# EAGLE design SimpleSwitchPirLightCO2_RFM69W (EAGLE 6.6.0)
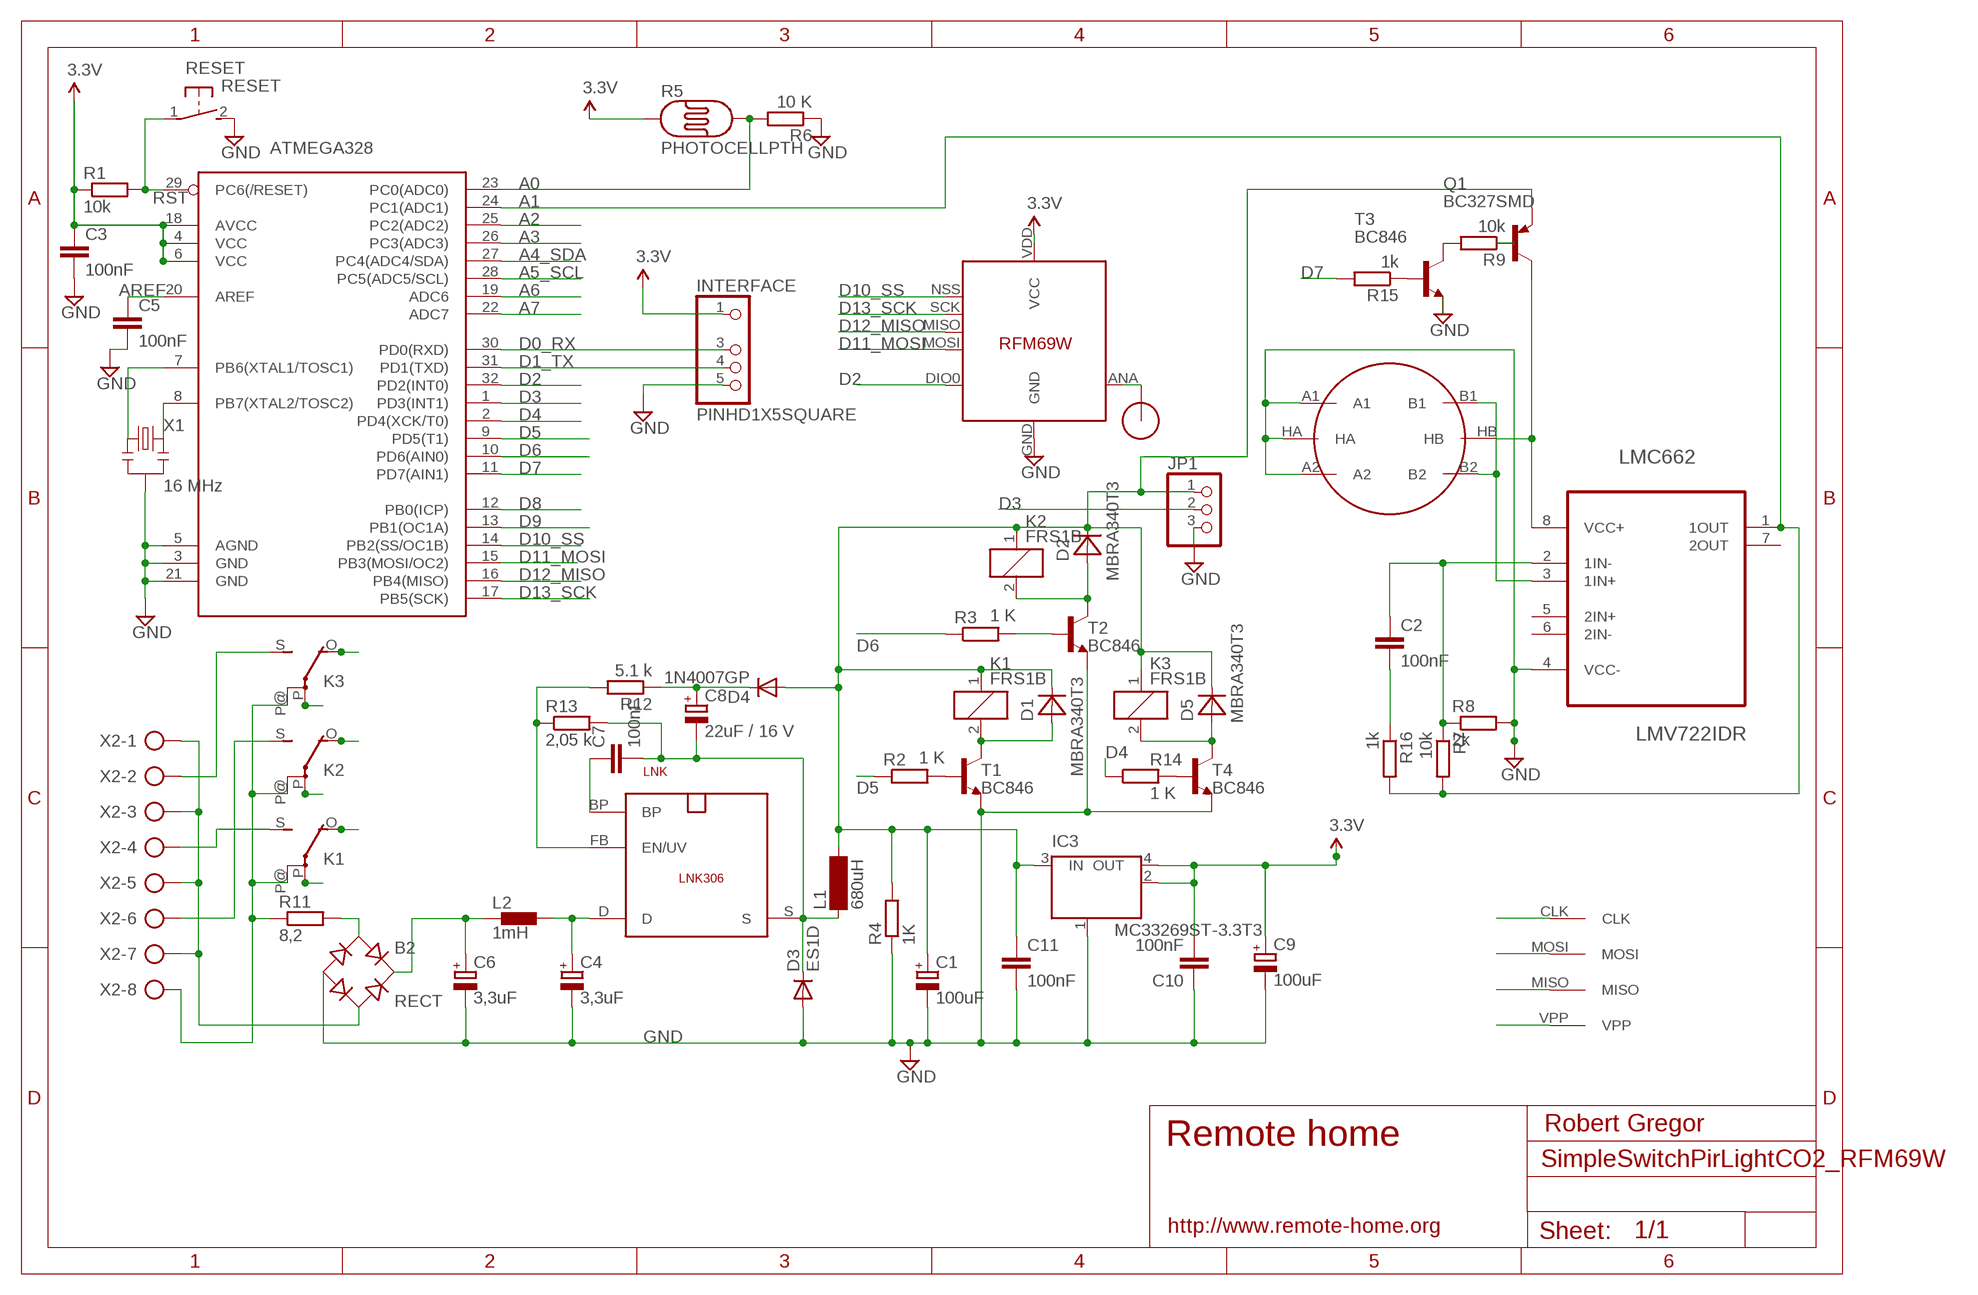
[diagram p0: schematic, sheet 1]

## Parts
ATMEGA328  ATMega-328  ATMEGA168/328TQFP32  [TQFP32-08]
B2  RECT  RECTIFIER-S40  [TO-269AA]
C1  100uF  CPOL-EUSMCB  [SMC_B]
C2  100nF  C-EUC2012  [C2012]
C3  100nF  C-EUC2012  [C2012]
C4  3,3uF  CPOL-EUE5-10.5  [E5-10,5]
C5  100nF  C-EUC2012  [C2012]
C6  3,3uF  CPOL-EUE5-10.5  [E5-10,5]
C7  100nF  C-EUC2012  [C2012]
C8  22uF / 16 V  CPOL-EUSMCC  [SMC_C]
C9  100uF  CPOL-EUSMCB  [SMC_B]
C10  100nF  C-EUC2012  [C2012]
C11  100nF  C-EUC2012  [C2012]
D1  MBRA340T3  [SMA]
D2  MBRA340T3  [SMA]
D3  ES1D  DIODE-DO214AC  [DO214AC]
D4  1N4007GP  DIODE-DO214AA  [DO214AA]
D5  MBRA340T3  [SMA]
IC3  MC33269ST-3.3T3  [SOT223]
INTERFACE  PINHD1X5SQUARE  [PINHD1X05-SQUARE]
JP1  PINHD-1X03_2.54-S  [1X03-S]
K1  FRS1B  [FRS1B]
K2  FRS1B  [FRS1B]
K3  FRS1B  [FRS1B]
L1  680uH  BS11  [BS11]
L2  1mH  BL02RN1  [BL02RN1]
LMC662  LMV722IDR  [SOIC127P600X175-8N]
LNK  LNK306  SO-8C  [SO-8C]
Q1  BC327SMD  [SOT23-BEC]
R1  10k  R-EU_R2012  [R2012]
R2  1 K  R-EU_M2012  [M2012]
R3  1 K  R-EU_M2012  [M2012]
R4  1K  R-EU_M2012  [M2012]
R5  PHOTOCELLPTH  [PHOTOCELL]
R6  10 K  R-EU_M2012  [M2012]
R7  10k  R-EU_R2012  [R2012]
R8  2k  R-EU_R2012  [R2012]
R9  10k  R-EU_R2012  [R2012]
R11  8,2  R-EU_0411/12  [0411/12]
R12  5.1 k  R-EU_M2012  [M2012]
R13  2,05 k  R-EU_M2012  [M2012]
R14  1 K  R-EU_M2012  [M2012]
R15  1k  R-EU_R2012  [R2012]
R16  1k  R-EU_R2012  [R2012]
RESET  RESET  DTSM-3  [DTSM-3]
RFM69  RFM69W  [RFM69W]
T1  BC846  [SOT23]
T2  BC846  [SOT23]
T3  BC846  [SOT23]
T4  BC846  [SOT23]
U$1  RFM12B_ANTENNA  [RFM12B-ANTENNA]
U$2  AVRHEADERDIP  [AVRHEADER]
U$4  METHANE_SENSOR  [MQ-3]
X1  16 MHz  RESONATORSMD  [RESONATOR-SMD]
X2  AK500/8  [AK500/8]

## Nets
6V: C1.+ C11.1 D1.C D2.C D4.A D5.C IC3.3(IN) JP1.1 K1.1 K2.1 K3.1 L1.2 Q1.E R4.2
A0: ATMEGA328.23(PC0(ADC0)) R5.2 R6.2
A1: ATMEGA328.24(PC1(ADC1)) LMC662.1(1OUT) R7.2 R16.2
A2: ATMEGA328.25(PC2(ADC2))
A3: ATMEGA328.26(PC3(ADC3))
A4_SDA: ATMEGA328.27(PC4(ADC4/SDA))
A5_SCL: ATMEGA328.28(PC5(ADC5/SCL))
A6: ATMEGA328.19(ADC6)
A7: ATMEGA328.22(ADC7)
AREF: ATMEGA328.20(AREF) C5.1
D0_RX: ATMEGA328.30(PD0(RXD)) INTERFACE.3
D1_TX: ATMEGA328.31(PD1(TXD)) INTERFACE.4
D2: ATMEGA328.32(PD2(INT0)) RFM69.DIO0
D3: ATMEGA328.1(PD3(INT1)) JP1.2
D4: ATMEGA328.2(PD4(XCK/T0)) R14.1
D5: ATMEGA328.9(PD5(T1)) R2.1
D6: ATMEGA328.10(PD6(AIN0)) R3.1
D7: ATMEGA328.11(PD7(AIN1)) R15.2
D8: ATMEGA328.12(PB0(ICP))
D9: ATMEGA328.13(PB1(OC1A))
D10_SS: ATMEGA328.14(PB2(SS/OC1B)) RFM69.NSS(SEL)
D11_MOSI: ATMEGA328.15(PB3(MOSI/OC2)) RFM69.MOSI U$2.MOSI
D12_MISO: ATMEGA328.16(PB4(MISO)) RFM69.MISO U$2.MISO
D13_SCK: ATMEGA328.17(PB5(SCK)) RFM69.SCK U$2.CLK
FB: LNK.FB(EN/UV) R12.2 R13.1
GND [power]: ATMEGA328.3(GND) ATMEGA328.5(AGND) ATMEGA328.21(GND) B2.- C1.- C3.2 C4.- C5.2 C6.- C9.- C10.1 C11.2 D3.A IC3.1(GND/ADJ) INTERFACE.5 JP1.3 LMC662.4(VCC-) R4.1 R6.1 R8.2 RESET.2 RFM69.GND T1.2(E) T2.2(E) T3.2(E) T4.2(E) U$4.A1 U$4.A2 U$4.HA X1.2
N$1: ATMEGA328.7(PB6(XTAL1/TOSC1)) X1.1
N$2: R2.2 T1.1(B)
N$3: RFM69.ANA(ANT) U$1.P$1
N$4: LMC662.3(1IN+) U$4.B1 U$4.B2
N$5: D1.A K1.2 T1.3(C)
N$6 [220V]: K3.S(2:S) X2.2
N$7 [220V]: K2.S(2:S) X2.6
N$8 [220V]: K1.P@(2:P) K2.P@(2:P) K3.P@(2:P) R11.1 X2.8
N$9 [220V]: B2.AC2 X2.1 X2.3 X2.5 X2.7
N$10: D5.A K3.2 T4.3(C)
N$11: D2.A K2.2 T2.3(C)
N$12: R3.2 T2.1(B)
N$13 [220V]: C4.+ L2.2 LNK.D
N$14 [220V]: B2.+ C6.+ L2.1
N$15 [220V]: B2.AC1 R11.2
N$16 [220V]: K1.S(2:S) X2.4
N$17: C2.1 LMC662.2(1IN-) R7.1 R8.1
N$18: C7.1 LNK.BP
N$19: LMC662.8(VCC+) Q1.C U$4.HB
N$20: C8.+ D4.C R12.1
N$21: ATMEGA328.8(PB7(XTAL2/TOSC2)) X1.3
N$22: R15.1 T3.1(B)
N$23: R9.2 T3.3(C)
N$24: Q1.B R9.1
N$25: C2.2 R16.1
N$26 [220V]: K3.O(2:O)
N$27: R14.2 T4.1(B)
N$50 [220V]: K2.O(2:O)
N$51 [220V]: K1.O(2:O)
N$52 [220V]: K1.P(2:P)
N$53 [220V]: K2.P(2:P)
N$54 [220V]: K3.P(2:P)
RST: ATMEGA328.29(PC6(/RESET)) R1.2 RESET.1 U$2.VPP
S: C7.2 C8.- D3.C L1.1 LNK.S R13.2
VCC: ATMEGA328.4(VCC) ATMEGA328.6(VCC) ATMEGA328.18(AVCC) C3.1 C9.+ C10.2 IC3.2(OUT) IC3.4(OUT) INTERFACE.1 R1.1 R5.1 RFM69.VDD(VCC) ; supply symbol labelled 3.3V
Unconnected: LMC662.5(2IN+) LMC662.6(2IN-) LMC662.7(2OUT)

## Notes on the sheet
- Robert Gregor
- Remote home
- http://www.remote-home.org

## Library data of the parts
ATMEGA328 = LowPowerLab:ATMEGA168/328: Atmel 32-pin 8-bit micro, 16k flash.
B2 = rectifier:RECTIFIER-: Rectifier
C1 C4 C6 C8 C9 = resistor:CPOL-EU: POLARIZED CAPACITOR, European symbol
C2 C3 C5 C7 C10 C11 = resistor:C-EU: CAPACITOR, European symbol
D1 D2 D5 = diode:MBRA340T3: Surface Mount Schottky Power Rectifier Source: http://www.onsemi.com/pub_link/Collateral/MBRA340T3-D.PDF
D3 D4 = diode:DIODE-: DIODE
IC3 = linear:MC33269ST*: Adjustable Output Low Dropout Voltage Regulator 800 mA Source: http://www.onsemi.com/pub/Collateral/MC33269-D.PDF
INTERFACE = eagle-library-edeca.net-v5:PINHD1X5
JP1 = pinhead-2:PINHD-1X03: PIN HEADER
K1-K3 = relay:FRS1B: RELAY 1 x switch, same as V23101-D6-A201, Siemens; OC_FARNELL: unknown; OC_NEWARK: unknown
L1 = inductor-neosid:BS: INDUCTOR nominal inductance, magnetically screened; OC_FARNELL: unknown; OC_NEWARK: unknown
L2 = inductors:BL0: Noise Suppression Products/EMI Suppression Filters, Lead EMIFIL(R) Inductor Type Source: http://www.murata.com .. BL01RN1_DS.pdf
LMC662 = Texas Instruments_By_element14_Batch_1:LMV722IDR: OPERATIONAL AMPLIFIERS; MPN: LMV722IDR; OC_FARNELL: -; OC_NEWARK: 02M3640; PACKAGE: SOIC-8; SUPPLIER: Texas Instruments
LNK = powerint:SO-8C: 700V MOSFET für Schaltnetz-Trafos. Pin 3 fehlt. SMD
Q1 = transistor-pnp:BC327*: PNP Transistror
R1-R4 R6-R9 R11-R16 = resistor:R-EU_: RESISTOR, European symbol
R5 = SparkFun-Sensors:PHOTOCELL: CdS photoresistor. This is a low cost way to detect light levels. Resistance decreases with more incoming light. SparkFun SKU: SEN-09088
RESET = switch-tact:DTSM-3
RFM69 = RemoteHome:RFM69W
T1-T4 = transistor:BC846: NPN TRANSISTOR
U$1 = LowPowerLab:RFM12B_ANTENNA
U$2 = RemoteHome:AVRHEADER
U$4 = SparkFun-Sensors:METHANE_SENSOR: MQ-4 Methane Gas Sensor SEN-09404
X1 = SparkFun:RESONATOR: Resonator Small SMD resonator. This is the itty bitty 10/20MHz resonators with built in caps. CSTCE10M0G55 and CSTCE20M0V53. Footprint has been reviewed closely but hasn't been tested yet.
X2 = con-ptr500:AK500/8: CONNECTOR; OC_FARNELL: unknown; OC_NEWARK: unknown

## Net classes
1 power: width 0.381 mm, clearance 0.254 mm
2 220V: width 0.381 mm, clearance 0.508 mm

## Board
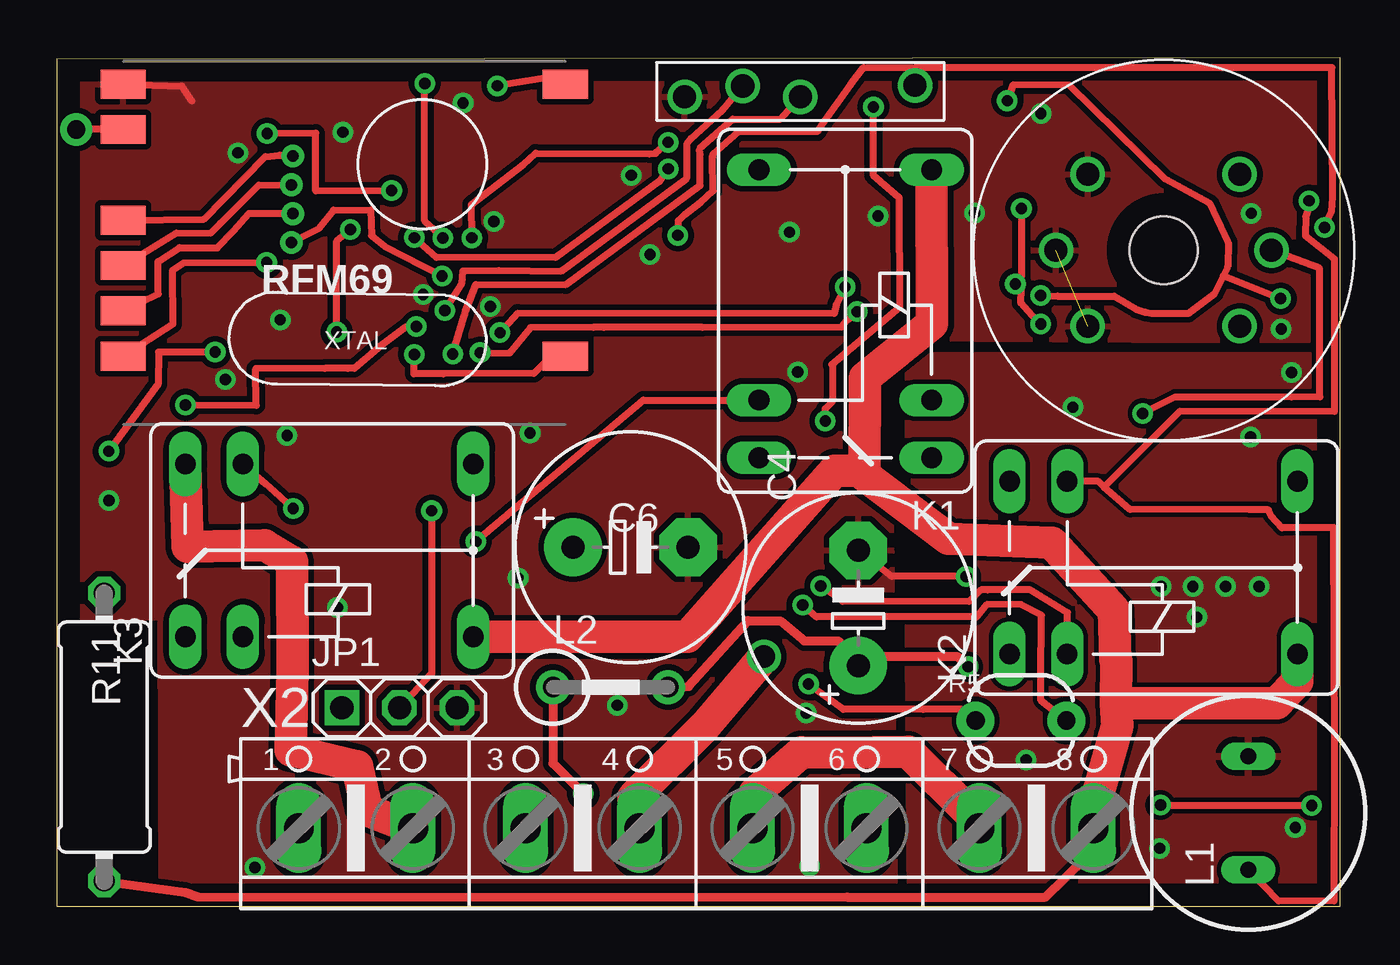
[diagram p1: board, top side]
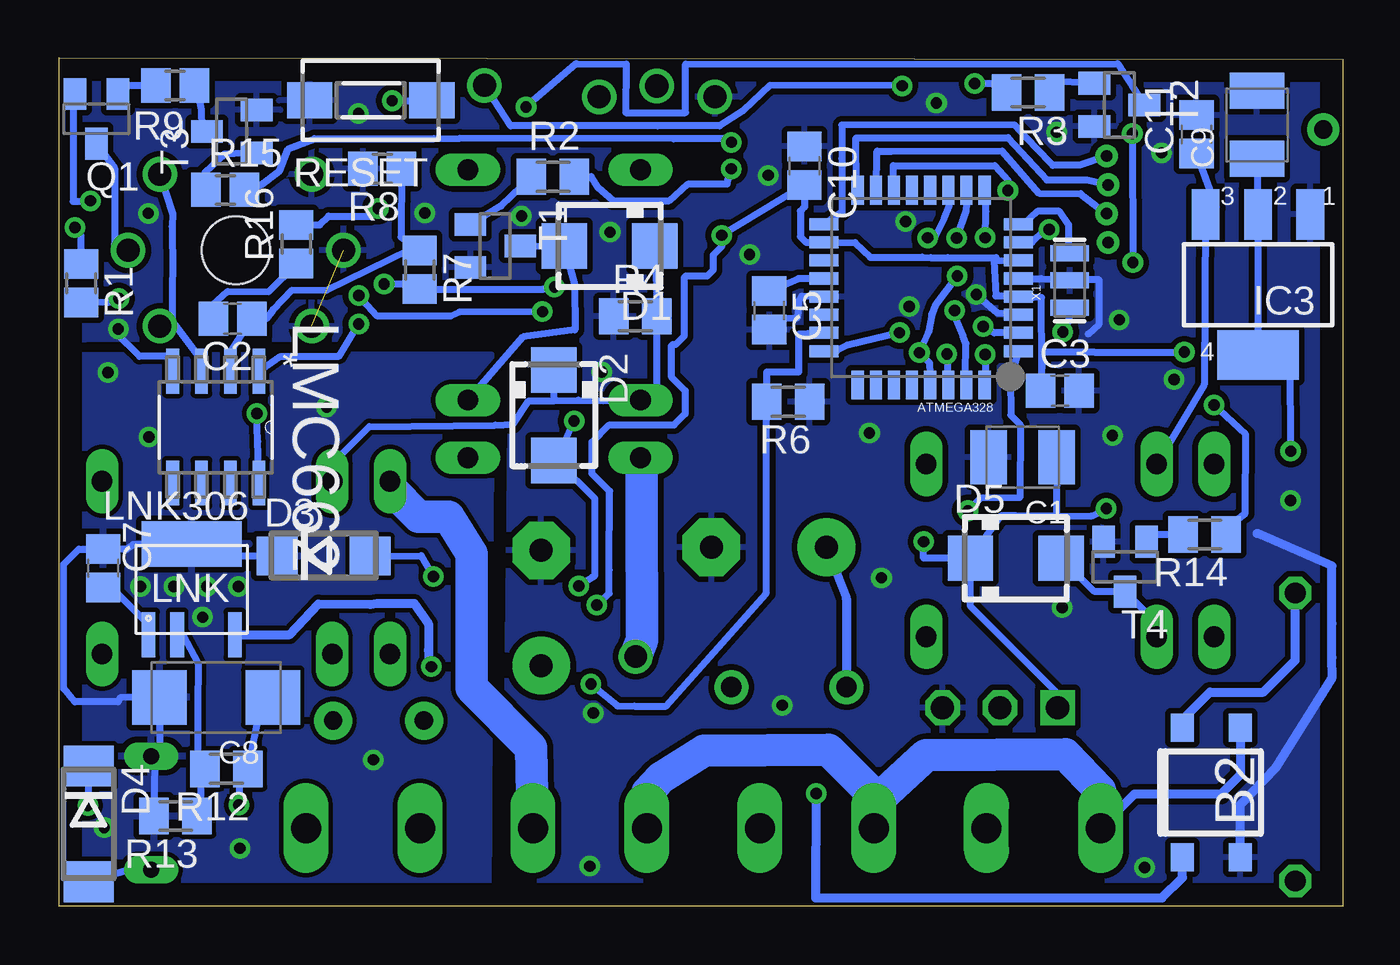
[diagram p2: board, bottom side, seen from below]

Size 56.63 x 37.42 mm. Coordinates in mm from the lower left corner, seen from the top.
Outline: 0,0 56.63,0 56.63,37.42 0,37.35 0,0
Copper layers (1*16): Top 0.035mm / dielectric 1.5mm / Bottom 0.035mm
Design rules "default": minimum track width 10mil, minimum drill 24mil, track to track 8mil, track to pad 8mil, pad to pad 8mil, via to via 8mil, smd to smd 8mil, copper to edge 40mil, drill to drill 8mil, minimum pad ring 10mil, minimum via ring 8mil, stop-mask expansion 4mil, vias tented up to drill 0mil, thermal gap 10mil

### Footprints (pad centres in the part's own frame; a part is rotated, then mirrored left to right if it is on the bottom)
TQFP32-08 = smd 1.27 x 0.533: 1 -4.293,2.8; 2 -4.293,2; 3 -4.293,1.2; 4 -4.293,0.4; 5 -4.293,-0.4; 6 -4.293,-1.2; 7 -4.293,-2; 8 -4.293,-2.8; 17 4.293,-2.8; 18 4.293,-2; 19 4.293,-1.2; 20 4.293,-0.4; 21 4.293,0.4; 22 4.293,1.2; 23 4.293,2; 24 4.293,2.8 | smd 0.533 x 1.27: 9 -2.8,-4.293; 10 -2,-4.293; 11 -1.2,-4.293; 12 -0.4,-4.293; 13 0.4,-4.293; 14 1.2,-4.293; 15 2,-4.293; 16 2.8,-4.293; 25 2.8,4.293; 26 2,4.293; 27 1.2,4.293; 28 0.4,4.293; 29 -0.4,4.293; 30 -1.2,4.293; 31 -2,4.293; 32 -2.8,4.293
TO-269AA = smd 1 x 1.25: + -1.28,-2.855; - 1.28,-2.855; AC1 -1.28,2.855; AC2 1.28,2.855
SMC_B = smd 1.6 x 2.4: + -1.5,0; - 1.5,0
C2012 = smd 1.3 x 1.5: 1 -0.85,0; 2 0.85,0
E5-10,5 = drill 1.016 pad 2.54: + -2.54,0 | drill 1.016 pad 2.54 octagon: - 2.54,0
SMC_C = smd 2.4 x 2.4: + -2.5,0; - 2.5,0
SMA = smd 2 x 2: A 2,0; C -2,0
DO214AC = smd 1.8 x 1.7: A 2.05,0; C -2.05,0
DO214AA = smd 1.8 x 2.2: A 2.55,0; C -2.55,0
SOT223 = smd 1.219 x 2.235: 1 -2.311,-3.099; 2 0,-3.099; 3 2.311,-3.099 | smd 3.6 x 2.2: 4 0,3.099
PINHD1X05-SQUARE = drill 1.016: 1 -5.061,-0.269; 3 0,0.24; 4 2.54,-0.24; 5 5.099,0.24
1X03-S = drill 1.016 square: 1 -2.54,0 | drill 1.016 octagon: 2 0,0; 3 2.54,0
FRS1B = drill 0.914 long: 1 0,3.81; 2 0,-3.81; O -2.54,-3.81; P 10.16,3.81; P@ 10.16,-3.81; S -2.54,3.81
BS11 = drill 0.7 long: 1 -2.5,0; 2 2.5,0
BL02RN1 = drill 0.9 pad 1.5: 1 -2.54,0; 2 2.54,0
SOIC127P600X175-8N = smd 1.981 x 0.559: 1 -2.464,1.905; 2 -2.464,0.635; 3 -2.464,-0.635; 4 -2.464,-1.905; 5 2.464,-1.905; 6 2.464,-0.635; 7 2.464,0.635; 8 2.464,1.905
SO-8C = smd 0.6 x 2: BP -1.905,-2; D 1.905,-2; FB -0.635,-2 | smd 4.41 x 2: S 0,2
SOT23-BEC = smd 1 x 1.4: B -0.95,-1.1; C 0,1.1; E 0.95,-1.1
R2012 = smd 1.3 x 1.5: 1 -0.85,0; 2 0.85,0
M2012 = smd 1.3 x 1.6: 1 -0.95,0; 2 0.95,0
PHOTOCELL = drill 0.8 pad 1.676: 1 -2,0; 2 2,0
0411/12 = drill 0.914 octagon: 1 -6.35,0; 2 6.35,0
DTSM-3 = smd 2 x 1.6: 1 -2.7,0; 2 2.7,0
RFM69W = smd 2 x 1.27: ANA 9.27,-5; DIO0 -10.23,5; GND 9.27,-7; MISO 9.27,1; MOSI 9.27,3; NSS 9.27,5; SCK 9.27,-1; VDD -10.23,-7
SOT23 = smd 1 x 1.4: 1 -0.95,-1.1; 2 0.95,-1.1; 3 0,1.1
RFM12B-ANTENNA = drill 0.8 pad 1.422: P$1 0,0
AVRHEADER = drill 0.5: CLK 2.54,0; MISO 1.27,0.07; MOSI 0,0; VPP -1.27,0.072
MQ-3 = drill 1.016: A1 -3.35,3.35; A2 -3.35,-3.35; B1 3.35,3.35; B2 3.35,-3.35; HA -4.75,0; HB 4.75,0 | hole 3: 0,0
RESONATOR-SMD = smd 0.7 x 1.7: 1 -1.2,0; 2 0,0; 3 1.2,0
AK500/8 = drill 1.321 long: 1 -17.526,0; 2 -12.497,0; 3 -7.518,0; 4 -2.489,0; 5 2.489,0; 6 7.518,0; 7 12.497,0; 8 17.526,0

### Placement (x,y rotation side)
ATMEGA328  18.6,27.29 180 bottom
B2  5.8,5.02 0 bottom
C1  14.13,19.81 180 bottom
C2  48.98,25.92 180 bottom
C3  12.49,22.74 0 bottom
C4  35.36,13.16 90 top
C5  25.3,26.28 270 bottom
C6  25.32,15.84 0 top
C7  54.69,14.91 90 bottom
C8  49.7,9.22 180 bottom
C9  3.79,34.47 90 bottom
C10  23.74,32.66 270 bottom
C11  6.45,34.04 90 bottom
D1  32.35,29.12 180 bottom
D2  34.81,21.66 270 bottom
D3  44.96,15.45 0 bottom
D4  55.33,3.64 270 bottom
D5  14.43,15.35 0 bottom
IC3  3.75,27.41 180 bottom
INTERFACE  32.81,35.94 180 top
JP1  15.12,8.76 0 top
K1  34.79,22.32 90 top
K2  44.58,14.94 0 top
K3  8.22,15.7 0 top
L1  52.57,4.12 270 top
L2  24.44,9.67 0 top
LMC662  49.72,21.13 270 bottom
LNK  50.79,13.98 0 bottom
Q1  54.99,34.73 180 bottom
R1  55.66,27.48 270 bottom
R2  34.84,32.17 180 bottom
R3  13.88,35.89 0 bottom
R4  31.22,26.03 0 bottom
R5  42.54,8.19 180 top
R6  24.47,22.25 180 bottom
R7  40.72,28.07 270 bottom
R8  42.37,32.52 180 bottom
R9  51.51,36.2 0 bottom
R11  2.1,7.46 90 top
R12  49.25,6.06 180 bottom
R13  51.49,3.98 180 bottom
R14  6.09,16.4 180 bottom
R15  49.3,31.59 0 bottom
R16  46.16,29.2 90 bottom
RESET  42.88,35.55 180 bottom
RFM69  12.21,29.26 180 top
T1  37.39,29.12 270 bottom
T2  9.86,35.34 270 bottom
T3  49.01,34.17 90 bottom
T4  9.6,14.98 180 bottom
U$1  0.87,34.26 0 top
U$2  10.42,30.55 90 top
U$4  48.84,28.93 0 top
X1  12.05,27.6 90 bottom
X2  28.21,3.45 0 top

### Tracks (layer width: path | path; a pad name or v marks a point on that pad's centre or on a via)
6V  (via drill 0.5)
  Top 0.305: v55.25,31.11 55.32,31.11 55.1,30.42 55.09,29.57 56.37,28.55 56.37,21.82 49.55,21.83 46.23,18.51 46.19,18.51 | K2.1 45.96,18.74 46.19,18.51 | 46.19,18.51 47.35,17.51 52.61,17.49 53.46,17.48 53.57,17.21 54.06,16.69 56.38,16.69 56.36,16.64 56.34,16.64 56.38,6.78 56.36,0.24 53.9,0.23 L1.2 | v10.44,17.54 9.62,18.28 9.22,18.63 K3.1 | v18.49,16.08 25.89,22.32 K1.1
  Bottom 0.305: Q1.E 56.02,35.68 56.02,31.09 55.25,31.09 v55.25,31.11 | D1.C 30.27,26.62 R4.2 30.27,22.97 K1.1 32.64,22.31 33.72,22.32 34.8,22.29 | D4.A 53.6,1.61 L1.2 | K2.1 44.57,18.76 44.57,19.54 42.95,21.15 37.39,21.22 36.61,21.26 35.92,22.29 34.8,22.29 | D5.C 15.09,17.22 14.4,17.22 12.63,17.22 | D2.C 34.81,22.63 34.8,22.29 | 12.63,17.22 11.1,17.21 v10.44,17.54 | JP1.1 12.58,9.38 16.43,13.22 D5.C | C11.1 5.58,30.79 IC3.3 6.11,23 K3.1 | C1.+ 12.63,17.22 | D5.C 18.5,15.35 v18.5,16.08 v18.49,16.08
A0  (via drill 0.5)
  Top 0.305: R5.2 39.94,8.69 38.23,8.69 34.7,8.69 v33.17,9.8
  Bottom 0.305: v33.17,9.8 32.01,8.84 31.25,8.84 29.86,8.83 25.43,13.81 25.43,18.88 R6.2 25.43,23.56 24.01,23.56 24.02,25.22 ATMEGA328.23
A1  (via drill 0.5)
  Top 0.305: v42.56,30.78 42.56,27.76 v42.29,27.45 42.55,27.21 42.53,26.61 43.37,25.68 v43.42,25.68 | v34.78,27.31 34.39,26.55 34.3,26.14 20.34,26.15 v19.56,25.3
  Bottom 0.305: R16.2 45.13,30.05 44.75,30.44 42.9,30.44 v42.56,30.78 | v42.29,27.45 41.16,27.46 41.16,26.74 41.01,26.74 R7.2 35.29,27.22 v34.78,27.31 | v19.56,25.3 21.86,24.75 22.33,24.49 ATMEGA328.24 | v43.42,25.68 44.27,24.27 46.85,24.26 47.52,23.8 LMC662.1
AREF
  Bottom 0.305: ATMEGA328.20 24.02,27.69 C5.1
D0_RX  (via drill 0.5)
  Top 0.305: v17.47,24.35 18,26.1 18.05,26.26 18.5,27.43 22.45,27.42 28.39,31.8 28.39,33.17 28.36,33.4 29.83,34.72 31.93,34.71 INTERFACE.3
  Bottom 0.305: ATMEGA328.30 17.43,24.2 v17.47,24.35
D1_TX  (via drill 0.5)
  Top 0.305: v17.12,26.27 17.88,27.48 17.92,28.02 19.51,28.04 22.25,28.01 27.81,32.11 27.81,33.65 27.98,33.86 29.37,35.11 INTERFACE.4
  Bottom 0.305: 16.58,23.05 16.64,23.49 16.62,24.82 16.76,25.16 17.06,25.9 v17.12,26.27
  Bottom 0.406: ATMEGA328.31 16.67,22.99 16.67,23.05 16.58,23.05
D2  (via drill 0.5)
  Top 0.305: v15.78,24.34 15.76,23.48 17.06,23.49 21.06,23.51 21.71,24.16 22.36,24.19 RFM69.DIO0
  Bottom 0.305: v15.78,24.34 15.77,23.03 ATMEGA328.32
D3  (via drill 0.5)
  Top 0.305: v16.54,17.45 16.54,10.28 JP1.2
  Bottom 0.305: ATMEGA328.1 14.67,23.34 14.64,21.66 14.23,21.24 14.25,18.02 15.99,18 v16.54,17.45
D4  (via drill 0.5)
  Top 0.305: v15.87,25.57 15.39,25.54 14.17,24.61 13.13,23.72 12.85,23.72 11.84,23.72 8.79,23.71 8.8,22.09 v5.68,22.12
  Bottom 0.305: ATMEGA328.2 15.39,25.29 v15.87,25.57 | R14.1 4.95,16.82 4.31,17.33 4.29,20.81 v5.68,22.12
D5  (via drill 0.5)
  Top 0.305: v26.98,32.53 26.6,31.97 22,28.61 16.75,28.62 v15.77,29.49
  Bottom 0.305: v15.77,29.49 15.74,30.65 15.76,31.23 15.82,31.57 ATMEGA328.9 | R2.1 33.16,32.18 32.88,31.71 32.19,31.11 29.71,31.12 28.88,31.86 27.16,31.86 v26.98,32.53
D6  (via drill 0.5)
  Top 0.305: v17.04,29.48 16.24,30.22 v16.24,36.29
  Bottom 0.305: 16.64,31.57 16.57,31.57 16.62,30.68 v17.04,29.48 | v16.24,36.29 15.5,36.29 R3.1
  Bottom 0.406: ATMEGA328.10 16.64,31.58 16.64,31.57
D7  (via drill 0.5)
  Top 0.305: v18.32,29.48 18.3,30.95 20.6,32.73 21.14,33.21 26.15,33.19 26.43,33.21 v26.97,33.69
  Bottom 0.305: ATMEGA328.11 17.38,30.85 17.58,30.36 18.03,29.49 v18.32,29.48 | v26.97,33.69 27.3,33.85 29.52,33.85 38.97,33.86 40.1,33.86 45.37,33.85 46.52,33.41 46.9,32.44 47.72,31.82 R15.2
D9
  Bottom 0.305: ATMEGA328.13
D10_SS  (via drill 0.5)
  Top 0.305: v14.78,31.56 11.43,31.54 11.43,34.1 v9.29,34.08 | v9.26,28.39 5.58,28.36 5.1,28.03 5.12,25.67 RFM69.NSS
  Bottom 0.305: ATMEGA328.14 19.83,32.67 15.35,32.67 14.75,32 v14.78,31.56 | v9.29,34.08 v9.26,28.39
D11_MOSI
  Top 0.305: RFM69.MOSI 4.48,27.02 4.48,28.44 5.43,29.05 7.08,29.04 7.81,29.8 8.48,30.55 10.27,30.55 U$2.MOSI
  Bottom 0.305: ATMEGA328.15 20.57,31.61 20.55,33.3 19.92,33.3 15.03,33.31 13.41,31.45 11.58,31.43 U$2.MOSI
D12_MISO
  Top 0.305: RFM69.MISO 5.29,29.7 6.79,29.69 7.2,30.11 8.93,31.82 9.92,31.79 U$2.MISO
  Bottom 0.305: ATMEGA328.16 21.46,31.69 21.48,33.89 20.42,33.89 14.77,33.9 13.06,32.03 11.3,32.03 U$2.MISO
D13_SCK
  Top 0.305: RFM69.SCK 6.5,30.31 9.2,33.06 9.85,33.13 U$2.CLK
  Bottom 0.305: 23.11,30.19 23,30.09 ATMEGA328.17 22.1,30.63 22.1,32.99 22.1,34.45 14.48,34.46 13.53,33.45 12.79,32.67 11.6,32.68 U$2.CLK
FB
  Bottom 0.305: R13.1 50.33,3.96 50.36,3.99 50.36,5.58 R12.2 50.17,6.45 50.51,6.45 50.51,8.79 50.51,10.7 51.19,11.98 LNK.FB
GND  (via drill 0.5)  (1 unrouted)
  Top 0.305: RFM69.GND 5.52,36.17 5.96,35.51 | v40.13,14.55 36.83,14.56 C4.-
  Bottom 0.305: ATMEGA328.21 23.86,26.91 24.02,26.68 24.06,25.94 24.67,25.92 25.25,25.63 C5.2 | RESET.2 46.44,35.55 | T3.2 47.97,35.16 | ATMEGA328.5 13.31,27.69 X1.2 | 11.24,25.24 10.75,25.68 10.75,27.62 11.63,27.63 | ATMEGA328.3 14.35,26.11 15.23,26.16 v16.17,26.98 | LMC662.4 51.62,24.1 51.78,24.26 53.09,24.26 54.13,25.3 | D3.A 40.66,15.47 v40.13,14.55
  Bottom 0.406: B2.- 4.52,4.49 2.96,6.12 0.47,10.08 0.48,10.98 0.48,12.47 0.48,15.02 3.78,16.44
  other vias: 52.7,30.56 36.23,30.45 32.33,29.73 7.99,33.23 26.17,28.74 20.88,20.87 43.42,34.96 17.93,35.42 12.63,34.14 19.13,26.46 20.35,14.49 12.39,13.18 8.74,1.71 32.69,23.56 7.44,23.23 2.31,17.9 9.86,25.87 25.35,32.24 19.29,30.2 24.73,8.86 33.22,1.77 33.06,8.52 10.16,20.76 40.5,30.58 54.02,25.46
  pour Top: 0.18,37.25 56.49,37.26 56.47,24.96 47.52,24.95 36.73,25.02 36.97,0.12 33.37,0.11 31.94,0.13 7.9,0.15 4.64,0.11 4.59,12.74 0.15,12.74 0.15,16.22
  pour Bottom: 10.55,37.3 56.49,37.26 56.48,24.92 55.16,25.03 36.7,25 36.97,0.11 23.42,0.13 23.35,0.16 23.15,0.15 0.15,0.16 0.21,37.24
N$1  (via drill 0.5)
  Top 0.305: v12.35,25.33 12.36,29.34 v12.96,29.85
  Bottom 0.305: X1.1 12.1,25.8 v12.35,25.33 | v12.96,29.85 13.2,29.8 13.72,29.28 14.3,29.28 ATMEGA328.7
N$2
  Bottom 0.305: R2.2 37.12,30.89 T1.1
N$3
  Top 0.305: RFM69.ANA U$1.P$1
N$4
  Bottom 0.305: U$4.B1 51.62,30.51 51.65,29.98 51.62,27.96 51.64,27.52 51.64,25.63 U$4.B2 51.63,25.6 51.49,25.63 50.46,24.24 LMC662.3
N$5
  Bottom 0.305: T1.3 34.88,29.07 D1.A 33.89,27.41 33.88,25.42 36.15,25.11 K1.2
N$6
  Top 1.422: X2.2 13.7,4.23 13.25,6.18 10.32,6.89 10.4,10.42 10.39,15.19 9.17,15.93 5.77,15.85 K3.S
N$7
  Bottom 1.422: K2.S 42.04,18.45 40.78,17.19 39.44,17.19 38.44,15.54 38.44,9.64 35.8,6.99 35.75,3.92 X2.6
N$8
  Top 0.406: R11.1 5.67,0.61 6.25,0.42 34.87,0.41 43.62,0.4 45.4,2.14 X2.8
  Top 1.422: K1.P@ 38.62,25.69 35.66,23.31 35.64,19.01 | 35.64,19.01 39.33,16.2 43.9,16.03 46.63,13.06 46.71,10.87 46.75,10.83 46.73,8.96 | K2.P@ 54.74,9.94 53.82,8.96 46.73,8.96 | 46.73,8.96 46.79,7.97 45.96,5.02 45.8,4.38 X2.8 | K3.P@ 27.83,11.9 34.32,19.22 35.63,19.22 35.64,19.01
N$9
  Top 1.422: X2.7 40.39,4.03 37.57,6.81 34.38,6.77 32.86,6.79 30.81,5.02 X2.5
  Bottom 0.406: B2.AC2 4.52,5.81 5.39,4.95 9.19,4.95 X2.1
  Bottom 1.422: X2.3 20.66,4.58 | 20.66,4.58 20.91,5.13 22.69,6.9 28.18,6.86 30.07,5.67 30.68,5.04 X2.5 | X2.1 10.73,5.11 12.23,6.7 18.4,6.66 20.66,4.58
N$10
  Bottom 0.305: D5.A 12.31,15.7 | 12.38,14.7 12.38,15.67 D5.A | K3.2 8.22,12.49 T4.3 10.96,13.88 D5.A
N$11  (via drill 0.5)
  Top 0.305: K2.2 44.59,12.96 42.93,13.97 41.07,13.96 40.78,13.96 40.25,13.44 34.68,13.45 v33.71,14.13 | v33.91,21.41 33.91,21.94 34.25,22.28 34.25,23.84 34.2,23.89 37.2,26.42 37.18,31.25 36.03,32.25 v36.03,35.25
  Bottom 0.305: v33.71,14.13 33.1,14.52 32.99,14.59 32.99,17.98 34.68,19.66 | D2.A 34.68,19.66 | 34.68,19.66 v33.91,21.41 | v36.03,35.25 33.83,37.16 31.62,37.14 31.64,35.01 28.99,35.01 29,37.14 9.93,37.16 T2.3
N$12
  Bottom 0.305: T2.1 12.49,36.37 R3.2
N$13  (via drill 0.5)
  Top 0.406: L2.2 27.87,9.7 30.5,12.6 31.93,12.58 32.99,11.7 34.48,11.7 C4.+ 35.84,11.01 39.76,11.01 v40.21,10.57
  Bottom 0.406: LNK.D 46.46,11.98 45.19,13.34 42.91,13.32 42.6,13.36 41.36,13.36 40.97,13.36 40.34,12.46 40.34,11.28 | 40.34,11.28 40.34,11.3 | 40.34,11.28 40.34,10.57 v40.21,10.57
N$14  (via drill 0.5)
  Top 0.406: L2.1 21.9,6.31 v23.23,4.97
  Bottom 0.305: B2.+
  Bottom 0.406: v23.23,4.97 23.26,0.37 7.98,0.37 7.08,1.27 B2.+ | C6.+ 21.9,13.59 L2.1
N$15
  Bottom 0.406: B2.AC1 7.08,8.23 5.86,9.45 3.51,9.45 2.1,10.85 R11.2
N$16  (via drill 1)
  Top 1.422: v31.2,11.01 28.59,7.91 25.44,4.81 25.44,3.51 X2.4
  Bottom 1.422: K1.S 30.94,19.78 30.94,17.75 30.93,11.72 v31.2,11.01
N$17
  Bottom 0.305: LMC662.2 49.06,24.45 C2.1 47.51,25.91 47.19,26.31 46.37,27.16 44.85,27.16 41.14,28.95 R7.1 41.55,29.52 R8.1
N$18
  Bottom 0.305: C7.1 54.31,14.06 52.68,12.43 52.68,11.34 LNK.BP
N$19  (via drill 0.5)
  Top 0.305: U$4.HB 55.71,28.13 55.73,22.46 54.48,22.47 53.89,22.45 49.33,22.45 v47.91,21.74
  Bottom 0.305: Q1.C 54.18,32.56 54.18,29.21 U$4.HB | LMC662.8 47.87,20.51 v47.91,21.74
N$20  (via drill 0.5)
  Top 0.305: v48.69,4.47 54.98,4.47 v55.37,4.45
  Bottom 0.305: 55.24,6.28 D4.C 55.33,4.43 v55.37,4.45 | C8.+ 47.74,8.77 R12.1 48.69,6.06 v48.69,4.47
N$21
  Bottom 0.305: ATMEGA328.8 14.08,30.08 13.45,30.67 12.53,30.67 12.1,30.06 12.1,28.79 X1.3
N$22
  Bottom 0.305: T3.1 49.33,33.17 50.2,32.36 50.2,31.69 R15.1
N$23
  Bottom 0.305: R9.2 50.54,35.99 50.35,35.12 50.35,34.31 T3.3
N$24
  Bottom 0.305: Q1.B 53.71,36.2 R9.1
N$25
  Bottom 0.305: C2.2 49.86,26.54 49.19,27.13 47.38,27.11 46.15,28.32 46.59,28.37 R16.1
N$27
  Bottom 0.305: R14.2 8.33,16.4 T4.1
RST  (via drill 0.5)
  Top 0.305: U$2.VPP 11.59,29.91 12.22,30.7 13.85,30.71 13.89,29.58 14.48,29.1 v17,27.8 | v41.94,35.53 42.19,36.23 44.67,36.21 48.9,32.07 50.89,30.98 51.68,29.28 51.66,28.21 51.47,27.8 | v35.31,26.22 35.14,26.06 34.83,25.82 34.62,25.55 28.49,25.53 24.15,25.53 23.67,25.53 20.9,25.52 19.98,24.39 19.05,24.37 v18.68,24.42 | v43.41,26.93 44.15,26.91 46.66,26.91 47.63,26.33 48.03,26.21 48.3,26.16 49.92,26.16 51.07,27.03 51.47,27.8 | v54,26.8 51.47,27.8
  Bottom 0.305: v17,27.8 17.96,26.52 18.13,26.12 18.29,25.3 v18.68,24.42 18.22,23.95 18.17,23.03 ATMEGA328.29 | R1.2 55.32,26.62 54.53,26.65 54.47,26.64 v54,26.8 | v41.94,35.53 40.2,35.53 RESET.1 | v35.31,26.22 38.97,26.21 39.36,26.03 41.03,26.03 41.28,26.03 42.59,26.03 v43.41,26.93
S  (via drill 0.5)
  Bottom 0.305: D3.C 50.61,15.45 LNK.S 53.37,15.96 53.65,15.75 C7.2 55.76,15.75 56.43,15.08 56.43,9.61 55.94,9.02 54.03,9.02 53.94,9.19 C8.- 52.2,6.8 L1.1 52.4,6.36 R13.2
  other vias: 50.3,12.75 48.73,14.11 50.12,14.11 51.57,14.11 53.04,14.11 48.66,2.56 54.64,3.48 44.83,22.01 52.67,20.69 54.47,23.54 42.76,6.46
  pour Bottom: 56.48,24.31 56.46,17.28 56.45,0.16 37.68,0.16 37.55,24.3 46.06,24.3 49.52,24.29
  pour Top: 37.61,24.32 56.48,24.31 56.43,0.18 37.66,0.16 37.56,14.03 37.57,24.03
VCC  (via drill 0.5)
  Top 0.305: v55.93,29.94 56.25,30.66 56.29,31.26 56.26,36.99 37.87,36.99 INTERFACE.1 37.86,37 35.6,36.98 35.03,36.22 33.74,34.44 33.56,34.17 30.09,34.16 28.94,33.17 28.94,33.02 28.96,31.55 28.41,31.05 27.72,30.51 27.43,30.24 v27.41,29.59 | RFM69.VDD 21.65,36.53 v19.44,36.19 | R5.1 43.43,9.07 43.42,10 43.44,12.83 42.54,13.31 41.05,13.32 40.59,12.77 33.52,12.77 v32.91,13.29 | v6.99,24.44 4.49,24.44 4.48,23.05 v2.3,20.07
  Bottom 0.305: 13.27,23.75 13.32,22.76 13.36,22.85 13.36,22.76 C3.1 13.29,22.74 | 13.27,23.75 13.29,26.85 13.67,26.86 14.26,26.93 ATMEGA328.4 14.31,26.92 15.31,26.92 15.38,28.47 | R1.1 55.66,29.58 v55.93,29.94 | 15.38,28.47 ATMEGA328.6 | 15.38,28.47 15.36,28.58 15.29,28.61 17.43,28.61 18.19,28.61 18.56,28.63 20.84,28.61 21.52,29.27 ATMEGA328.18 22.9,29.28 23.68,29.28 23.93,29.54 23.93,30.66 23.74,30.85 C10.2 24.78,31.19 v27.41,29.59 27.41,29.1 27.79,28.72 27.79,28.06 28.05,27.79 29,27.79 29.06,27.72 29.06,25.14 29.44,24.77 29.57,24.77 29.64,24.7 29.64,23.36 29.02,22.74 29.02,21.72 29.5,21.24 32.37,21.24 33.13,20.48 33.13,19.09 32.35,18.31 32.37,14.82 32.36,13.8 v32.91,13.29 | 13.27,23.75 13.27,24.43 10.93,24.43 v6.99,24.44 | v19.44,36.19 25.28,36.2 26.46,35.08 27.5,34.42 30.22,34.41 36.71,34.42 37.69,35.92 37.85,36.19 INTERFACE.1 | C9.+ IC3.2 IC3.4 2.32,24.13 v2.3,20.07